# Altium project TIDA-01592-E1.PrjPcb (part 1 of 4)
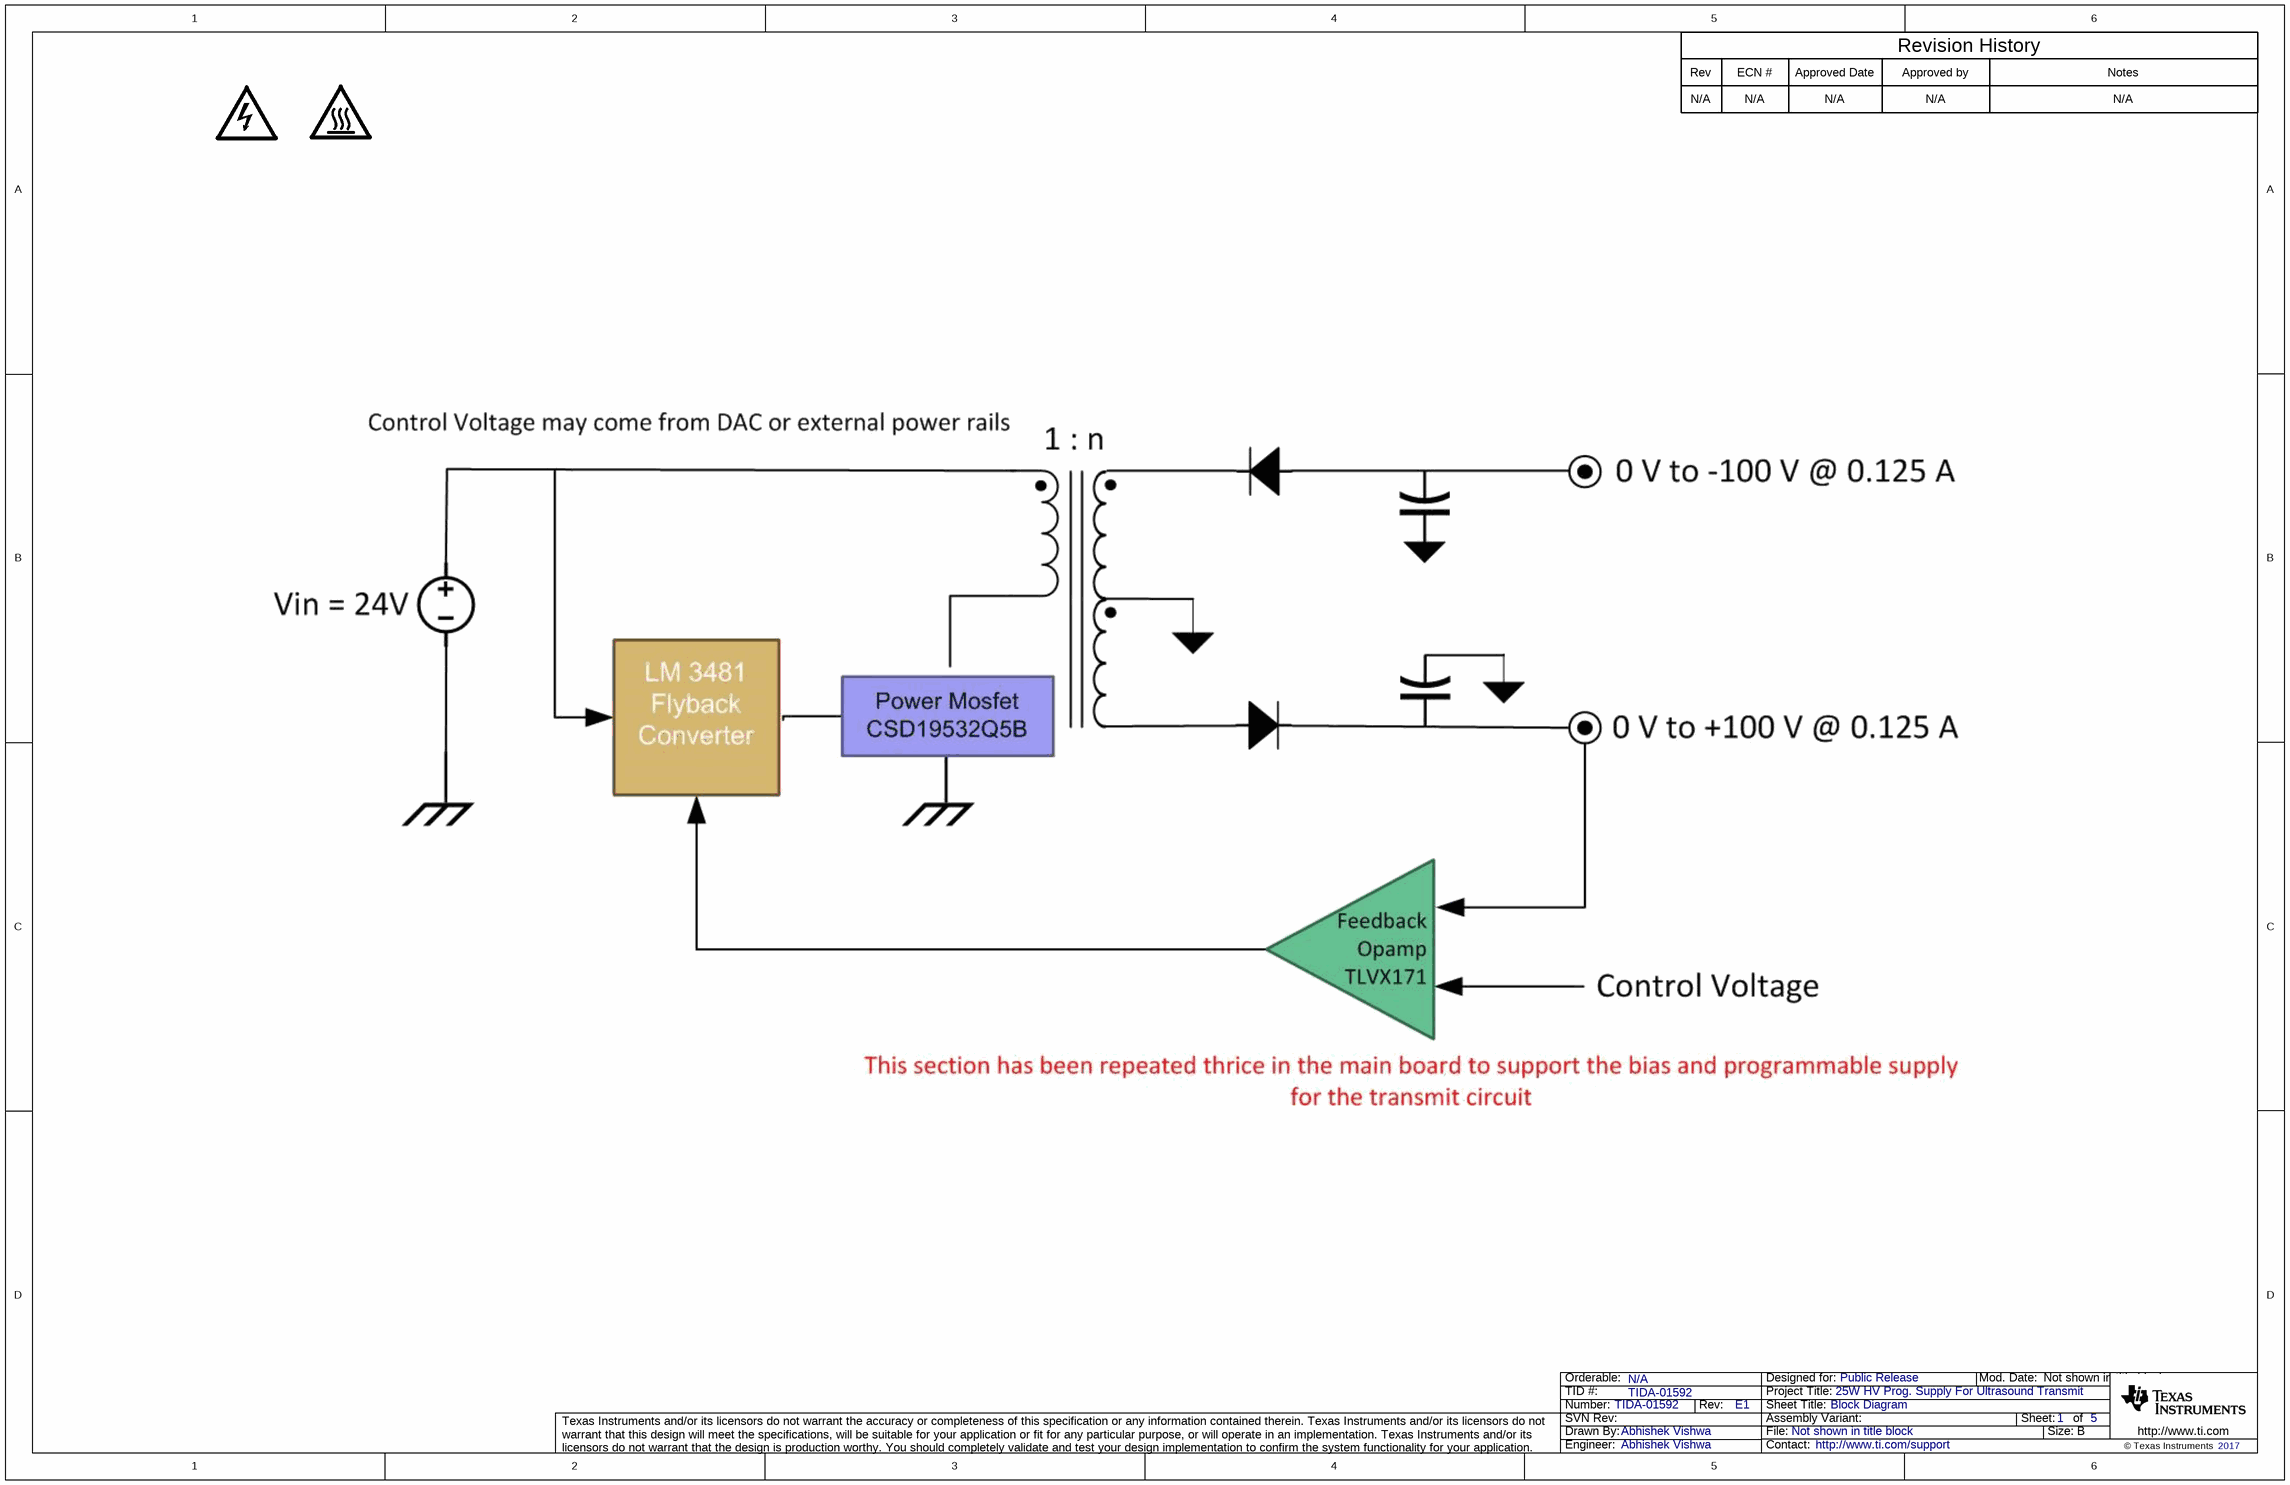
[diagram p0: TIDA-01592_CoverSheet.SchDoc]
CopyrightYear: 2017; EVM_orderable: N/A; PCB_Layout: Akshay Labhe; PCB_Rev: E1; PRJ_Customer: Public Release; PRJ_Engineer: Abhishek Vishwa; PRJ_Number: TIDA-01592; PRJ_Title: 25W HV Prog. Supply For Ultrasound Transmit; SCH_Rev: E1; TechSupport: http://www.ti.com/support; TID: TIDA-01592
5 sheets, 227 parts. Net scope: global (net labels, ports and power ports of the same name join across sheets).
Board file: TIDA-01592_PCB.PcbDoc
Sheets:
  TIDA-01592_CoverSheet.SchDoc
  TIDA-01592_Power Supply1.SchDoc
  TIDA-01592_Power Supply2.SchDoc
  TIDA-01592_Power Supply3.SchDoc
  TIDA-01592_Hardware.SchDoc

## Sheet TIDA-01592_CoverSheet.SchDoc: Block Diagram
size 431 x 279 mm; Date: Not shown in title block; ApprovedBy: Not shown in title block; CheckedBy: Not shown in title block; Author: Not shown in title block; CompanyName: Not shown in title block; DrawnBy: Abhishek Vishwa; Engineer: Abhishek Vishwa; Organization: Not shown in title block; Address1: Not shown in title block; Address2: Not shown in title block; Address3: Not shown in title block; Address4: Not shown in title block; DocumentNumber: 1; Revision: Use project parameter SCH_Rev; SheetNumber: 1; SheetTotal: 5; PageSetup: Record=PageOptions|CenterHorizontal=True|CenterVertical=True|PrintScale=1.00|XCorrection=1.00|YCorrection=1.00|PrintKind=0|BorderSize=5000000|LeftOffset=0|BottomOffset=0|Orientation=2|PaperLength=1000|PaperWidth=1000|Scale=100|PaperSource=15|PrintQuality=600|MediaType=1|DitherType=10|PaperKind=Letter|PrintScaleMode=1; CurrentTime: Not shown in title block; CurrentDate: Not shown in title block; Time: Not shown in title block; DocumentFullPathAndName: Not shown in title block; DocumentName: Not shown in title block; ModifiedDate: Not shown in title block; ImagePath: Not shown in title block; ProjectName: TGC for Ultrasound AFEs

### Parts
(Parts that share a designator on the sheet are numbered #1, #2 ... from top to bottom, then left to right.)
LOGO2#1  CAUTION HOT SURFACE  [IEC_HotSurface_Small]  (value not drawn)  (graphical)
LOGO8#1  DANGER HIGH VOLTAGE  [IEC_HighVoltage_Small]  (value not drawn)  (graphical)

### Notes on the sheet
- Rev
- N/A
- ECN #
- Approved Date
- Approved by
- Revision History
- Notes
- Drawn By:
- SVN Rev:
- Number:
- TID #:
- Orderable:
- Rev:
- Sheet Title:
- File:
- Project Title:
- Designed for:
- Assembly Variant:
- Mod. Date:
- Sheet:
- Size:
- of
- B
- http://www.ti.com
- Texas Instruments and/or its licensors do not warrant the accuracy or completeness of this specification or any information contained therein. Texas Instruments and/or its licensors do not warrant that this design will meet the specifications, will be suitable for your application or fit for any particular purpose, or will operate in an implementation. Texas Instruments and/or its licensors do not warrant that the design is production worthy. You should completely validate and test your design implementation to confirm the system functionality for your application.
- Engineer:
- Contact:
- © Texas Instruments

### Library data of the parts
LOGO2#1 = IEC_HotSurface: IEC 61010-1 Hot Surface Warning; SymbolCreator: a0412235; SymbolVersion: 2011-08-22; Published: 2009-03-03; Publisher: Texas Instruments; LatestRevisionDate: 2016-03-21
LOGO8#1 = IEC_HighVoltage: IEC 61010-1 High Voltage Warning; SymbolCreator: a0412235; SymbolVersion: 2011-08-22; Published: 2009-03-03; Publisher: Texas Instruments; LatestRevisionDate: 2016-03-21